# EasyEDA schematic SCH_led+esp32_2026-04-28.json
TITLE: Sheet_1; REV: 1.0; Date: 2026-04-28; Sheet: 1/1; Drawn By: kristina112; Company: Your Company
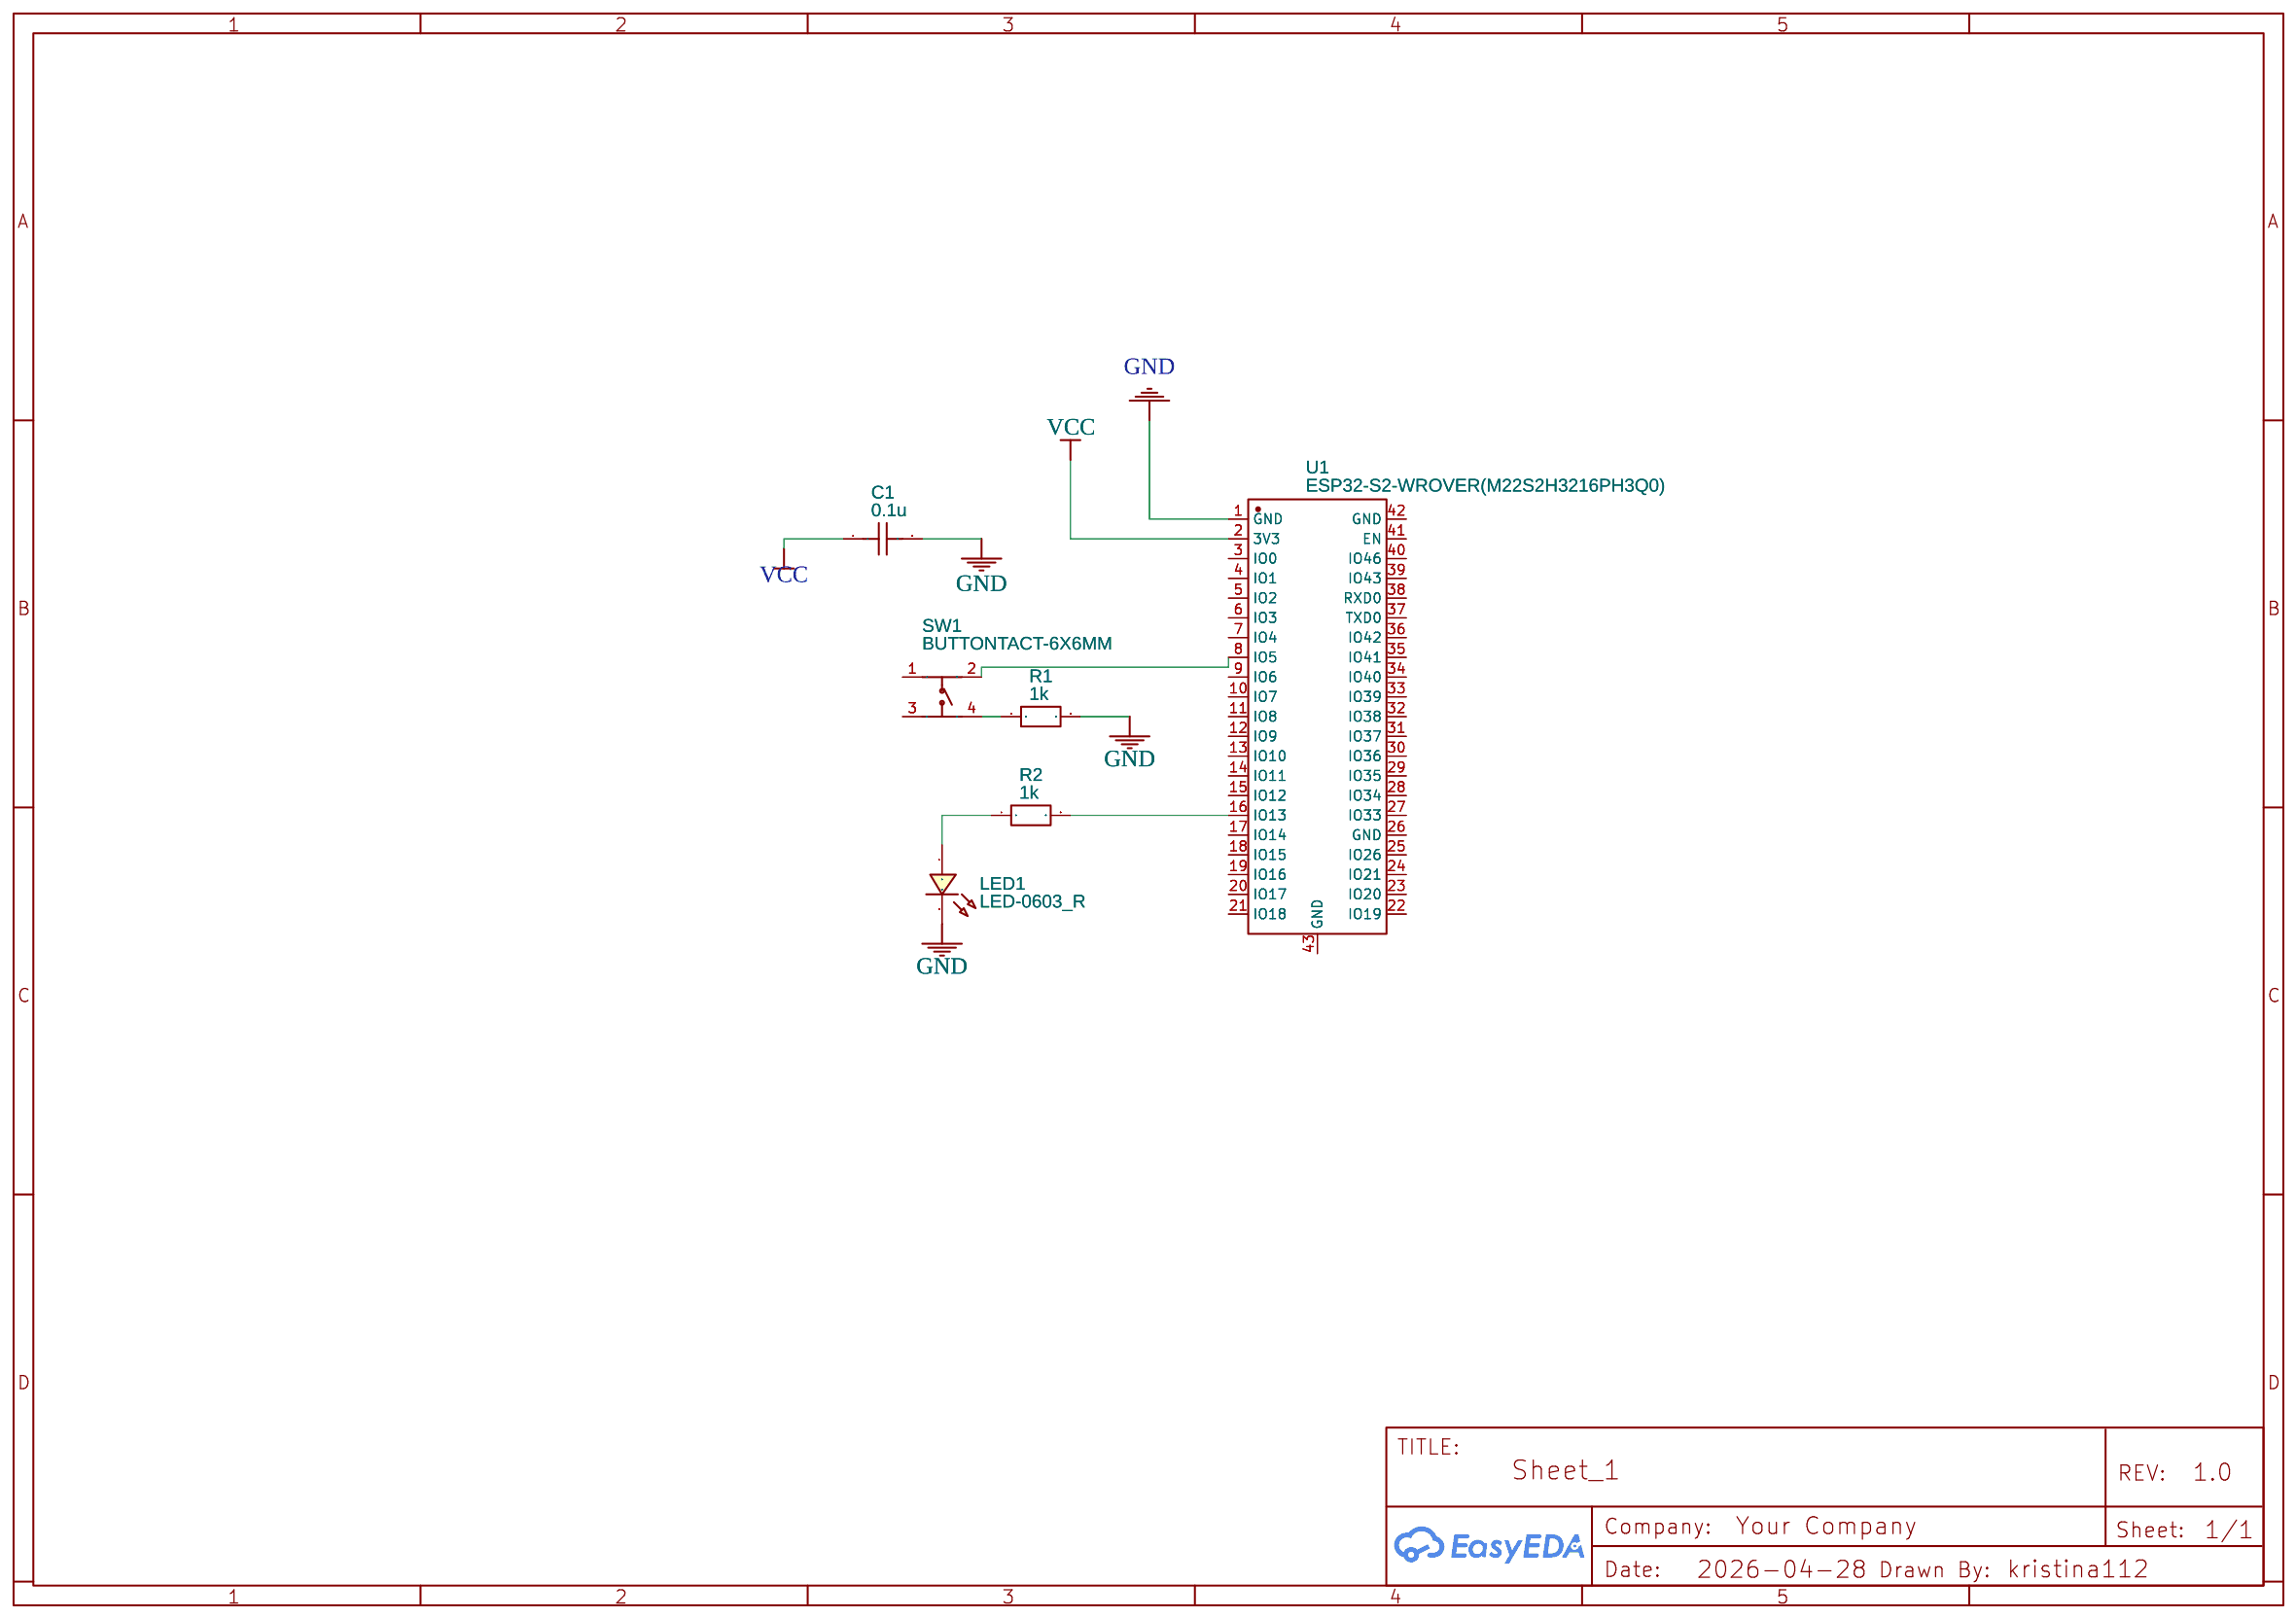
[diagram p0: schematic sheet]

## Parts
C1  0.1u  [C0603]
LED1  LED-0603_R  [LED0603_RED]
R1  1k  [R0603]
R2  1k  [R0603]
SW1  BUTTONTACT-6X6MM  [SW-SMD_4P-L6.0-W6.0-P4.50-LS9.2]
U1  ESP32-S2-WROVER(M22S2H3216PH3Q0)  [WIRELM-SMD_ESP32-S2-WROVER]

## Library data of the parts
C1 = C_0603_US: Contributor: LCEDA_Lib
LED1 = LED-0603_R: Manufacturer: EVERLIGHT(台湾亿光); Manufacturer Part: 19-217/R6C-AL1M2VY/3T; Supplier Part: C72044; Supplier: LCSC; Contributor: LCEDA_01
R1 R2 = R_0603_EU: Contributor: LCEDA_Lib
SW1 = BUTTONTACT-6X6MM: Contributor: LCSC; Supplier: LCSC; Supplier Part: C9900004221; Manufacturer Part: Buttontact-6x6mm; Manufacturer: null; JLCPCB Part Class: Extended Part
U1 = ESP32-S2-WROVER(M22S2H3216PH3Q0): Supplier: LCSC; Supplier Part: C6946014; Manufacturer: ESPRESSIF(乐鑫); Contributor: lcsc; JLCPCB Part Class: Extended Part

## Nets
GND: C1.2 LED1.2 R1.2 U1.1(GND)
VCC: C1.1 U1.2(3V3)
Net-(LED1-1): LED1.1 R2.1
Net-(R1-1): R1.1 SW1.4(D)
Net-(R2-2): R2.2 U1.16(IO13)
Net-(SW1-2): SW1.2(B) U1.8(IO5)

Not connected (* = marked no-connect by the designer): SW1 1(A) 3(C); U1 3(IO0) 4(IO1) 5(IO2) 6(IO3) 7(IO4) 9(IO6) 10(IO7) 11(IO8) 12(IO9) 13(IO10) 14(IO11) 15(IO12) 17(IO14) 18(IO15) 19(IO16) 20(IO17) 21(IO18) 22(IO19) 23(IO20) 24(IO21) 25(IO26) 26(GND) 27(IO33) 28(IO34) 29(IO35) 30(IO36) 31(IO37) 32(IO38) 33(IO39) 34(IO40) 35(IO41) 36(IO42) 37(TXD0) 38(RXD0) 39(IO43) 40(IO46) 41(EN) 42(GND) 43(GND)
